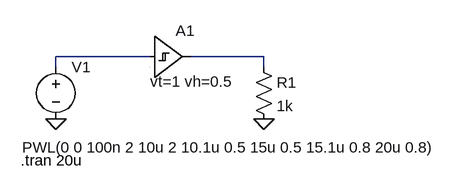
[diagram p0: schematic Schmitt_trigger.asc]
Schmitt_trigger.asc, the LTspice schematic file:
Version 4
SHEET 1 880 680
WIRE 128 160 -16 160
WIRE 304 160 192 160
WIRE -16 176 -16 160
WIRE 304 176 304 160
FLAG -16 256 0
FLAG 304 256 0
SYMBOL Digital\\schmtbuf 128 96 R0
WINDOW 3 1 102 Left 2
SYMATTR InstName A1
SYMATTR Value vt=1 vh=0.5
SYMBOL voltage -16 160 R0
WINDOW 3 -52 140 Left 2
WINDOW 123 0 0 Left 2
WINDOW 39 0 0 Left 2
SYMATTR InstName V1
SYMATTR Value PWL(0 0 100n 2 10u 2 10.1u 0.5 15u 0.5 15.1u 0.8 20u 0.8)
SYMBOL res 288 160 R0
SYMATTR InstName R1
SYMATTR Value 1k
TEXT -70 320 Left 2 !.tran 20u

The netlist it stands for:
* Schmitt_trigger.asc
A1 N001 0 0 0 0 0 N002 0 SCHMITT vt=1 vh=0.5
V1 N001 0 PWL(0 0 100n 2 10u 2 10.1u 0.5 15u 0.5 15.1u 0.8 20u 0.8)
R1 N002 0 1k
.tran 20u
.backanno
.end